# Altium schematic sheet bluetooth 3.SchDoc
size A3
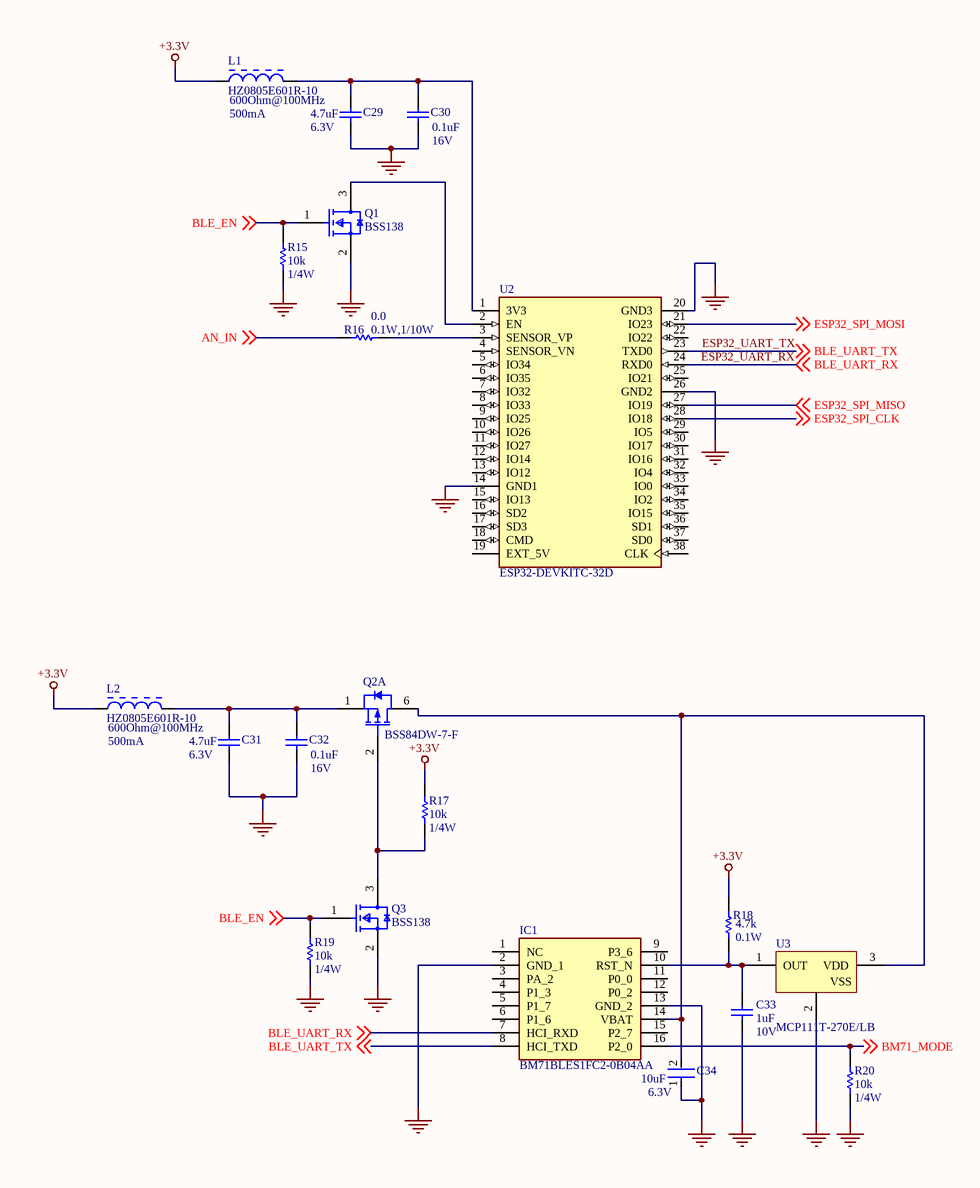
[diagram p0: bluetooth 3.SchDoc]

## Parts
C29  value 4.7uF  Voltage: 6.3V  [CAPC2013X145X50NL20T25]  (hidden comment: C0805C475K9PACTU)
C30  value 0.1uF  Voltage: 16V  [CAPC1608X87X35ML15T15]  (hidden comment: C0603C104M4RACTU)
C31  value 4.7uF  Voltage: 6.3V  [CAPC2013X145X50NL20T25]  (hidden comment: C0805C475K9PACTU)
C32  value 0.1uF  Voltage: 16V  [CAPC1608X87X35ML15T15]  (hidden comment: C0603C104M4RACTU)
C33  value 1uF  Voltage: 10V  [CAPC1608X90X35ML15T15]  (hidden comment: C0603C105K8RACTU)
C34  value 10uF  Voltage: 6.3V  [FP-CL10-IPC_C]  (hidden comment: CL10A106MQ8NNNC)
IC1  BM71BLES1FC2-0B04AA  [BM71BLES1FC2_1]
L1  HZ0805E601R-10  Impedance @ Frequency: 600Ohm@100MHz  Current Rating (Max): 500mA  [LIRD-LI0805H151R-10-2_V]
L2  HZ0805E601R-10  Impedance @ Frequency: 600Ohm@100MHz  Current Rating (Max): 500mA  [LIRD-LI0805H151R-10-2_V]
Q1  BSS138  [FP-318-08-IPC_B]
Q2  BSS84DW-7-F  [DIOD-SOT363-6_V]  (part A of 2)
Q3  BSS138  [FP-318-08-IPC_B]
R15  value 10k  Power: 1/4W  [RESC3216X70X50NL05T20]  (hidden comment: ERJ-8GEYJ103V)
R16  value 0.0  Power: 0.1W,1/10W  [RESC1608X55X35LL10T10]  (hidden comment: RC1608J000CS)
R17  value 10k  Power: 1/4W  [RESC3216X70X50NL05T20]  (hidden comment: ERJ-8GEYJ103V)
R18  value 4.7k  Power: 0.1W  [RESC1608X55X25LL10T15]  (hidden comment: RC0603FR-074K7L)
R19  value 10k  Power: 1/4W  [RESC3216X70X50NL05T20]  (hidden comment: ERJ-8GEYJ103V)
R20  value 10k  Power: 1/4W  [RESC3216X70X50NL05T20]  (hidden comment: ERJ-8GEYJ103V)
U2  ESP32-DEVKITC-32D  [MODULE_ESP32-DEVKITC-32D]
U3  MCP111T-270E/LB  [SC70-LB3_N]

## Nets
+3.3V: L1.1 L2.1 R17.1 R18.2
GND: C29.1 C30.1 C31.1 C32.1 C33.1 C34.1 IC1.2(GND_1) IC1.13(GND_2) Q1.2(S) Q3.2(S) R15.2 R19.2 R20.2 U2.14(GND1) U2.20(GND3) U2.26(GND2) U3.2(VSS)
AN_IN: R16.1 ; off-sheet AN_IN
BLE_EN: Q1.1(G) Q3.1(G) R15.1 R19.1 ; off-sheet BLE_EN
BM71_MODE: IC1.16(P2_0) R20.1 ; off-sheet BM71_MODE
ESP32_SPI_CLK: U2.28(IO18) ; off-sheet ESP32_SPI_CLK
ESP32_SPI_MISO: U2.27(IO19) ; off-sheet ESP32_SPI_MISO
ESP32_SPI_MOSI: U2.21(IO23) ; off-sheet ESP32_SPI_MOSI
ESP32_UART_RX: IC1.7(HCI_RXD) U2.24(RXD0) ; off-sheet BLE_UART_RX  [also labelled BLE_UART_RX]
ESP32_UART_TX: IC1.8(HCI_TXD) U2.23(TXD0) ; off-sheet BLE_UART_TX  [also labelled BLE_UART_TX]
NetC29_2: C29.2 C30.2 L1.2 U2.1(3V3)
NetC31_2: C31.2 C32.2 L2.2 Q2.1(S)
NetC33_2: C33.2 IC1.10(RST_N) R18.1 U3.1(OUT)
NetC34_2: C34.2 IC1.14(VBAT) Q2.6(D) U3.3(VDD)
NetQ1_3: Q1.3(D) U2.2(EN)
NetQ2_2: Q2.2(G) Q3.3(D) R17.2
NetR16_2: R16.2 U2.3(SENSOR_VP)

Not connected (* = marked no-connect by the designer): IC1 1(NC) 3(PA_2) 4(P1_3) 5(P1_7) 6(P1_6) 9(P3_6) 11(P0_0) 12(P0_2) 15(P2_7); U2 4(SENSOR_VN) 5(IO34) 6(IO35) 7(IO32) 8(IO33) 9(IO25) 10(IO26) 11(IO27) 12(IO14) 13(IO12) 15(IO13) 16(SD2) 17(SD3) 18(CMD) 19(EXT_5V) 22(IO22) 25(IO21) 29(IO5) 30(IO17) 31(IO16) 32(IO4) 33(IO0) 34(IO2) 35(IO15) 36(SD1) 37(SD0) 38(CLK)

## Notes on the sheet
- Title
- Size:
- Date:
- A3
- Number:
- Time:
- Revision:
- Sheet
- of
- File:

## Library data of the parts
C29 C31 = CMP-2007-01009-1: Manufacturer: Kemet; Alternative1: GRM219R61A475KE34D Murata; Alternative2: C0805C475K3PACTU KEMET; Alternative3: CC0805KKX5R7BB475 Yageo; Part Number: C0805C475K9PACTU; Package / Case: 0805
C30 C32 = CMP-2006-03067-1: Ceramic Capacitor 0.1uF 16V +-10% X7R0603; Manufacturer: Kemet; Alternative1: C1608X7R1E104K TDK; Alternative2: CC0603KRX7R8BB104 Yageo; Alternative3: GRM188R72A104KA35D Murata; Part Number: C0603C104M4RACTU; Package / Case: 0603
C33 = CMP-2006-02293-1: Manufacturer: Kemet; Alternative1: CL10B105KO8NNND Samsung; Alternative2: CC0603KPX7R7BB105 Yageo; Alternative3: GRM188R71C105KE15D Murata; Part Number: C0603C105K8RACTU; Package / Case: 0603
C34 = CMP-13271-001938-1: Cap Ceramic 10uF 6.3V X5R ±20% Pad SMD 0603 +85°C T/R; Manufacturer: Samsung; Alternative1: LMK107BJ106MALTD Taiyo Yuden; Alternative2: C1608X5R0J106K080AB TDK; Alternative3: 06036D106MAT2A Kyocera AVX; Height: 0.8mm; Width: 0.031inch; Min Operating Temperature: -55°C; Dielectric: X5R; Package / Case: 0603; Radiation Hardening: No; Packaging: Tape and Reel; Max Operating Temperature: 85°C; Thickness: 0.035inch; Mount: Surface Mount; Case Code (Imperial): 0603; Case Code (Metric): 1608; Depth: 0.8mm; Tolerance: 20%; Length: 1.6mm; Part Number: CL10A106MQ8NNNC
IC1 = BM71BLES1FC2-0B04AA: Integrated Circuit; Manufacturer_Name: Microchip; Datasheet Link: http://www.microchip.com/mymicrochip/filehandler.aspx?ddocname=en578477; Manufacturer_Part_Number: BM71BLES1FC2-0B04AA; Arrow Part Number: BM71BLES1FC2-0B04AA; Arrow Price/Stock: https://www.arrow.com/en/products/bm71bles1fc2-0b04aa/microchip-technology; Mouser Part Number: 579-BM71BS1FC2-BB04; Mouser Price/Stock: https://www.mouser.co.uk/ProductDetail/Microchip-Technology/BM71BLES1FC2-0B04AA?qs=w%2Fv1CP2dgqqgFQsF1zIUBg%3D%3D
L1 L2 = CMP-2000-05194-1: Chip Bead for Signal Filtering, 600 Ohm, 500 mA, -40 to 125 degC, 0805 (2012 Metric), RoHS, Tape and Reel; Manufacturer: Laird; Other Names: 240-2399-1; Kits: 240-2227-ND-KITEMIFERRITEBEADCHIPSMD; DC Resistance (DCR) (Max): 300mOhm; Filter Type: SignalLine; Operating Temperature: -40degC~125degC; Datasheet URL: https://datasheet.ciiva.com/22622/1685710-22622833.pdf; Mounting Type: SurfaceMount; Package / Case: 0805(2012Metric); Package Description: 2-Pin Surface Mount Device, Body 2 x 1.25 mm; Package Reference: LI0805H15R-10-2; Size / Dimension: 0.079"Lx0.049"W(2.00mmx1.25mm); Height (Max): 0.043"(1.10mm); Part Number: HZ0805E601R-10
Q1 Q3 = CMP-07173-000101-1: MOSFET N-CH 50V 220MA SOT-23; Turn-Off Delay Time: 20ns; Element Configuration: Single; Rds On Max: 3.5R; Gate to Source Voltage (Vgs): 20V; Threshold Voltage: 1.3V; Number of Elements: 1; Power Dissipation: 360mW; Rise Time: 9ns; Turn-On Delay Time: 2.5ns; Input Capacitance: 27pF; On-State Resistance: 6R; Alternative1: BSS138LT3G ON Semiconductor; Alternative2: BSS138W-7-F Diodes; Alternative3: 2N7002 STMicroelectronics; Lead Free: Lead Free; Length: 2.92mm; Width: 1.3mm; Drain to Source Breakdown Voltage: 50V; Min Operating Temperature: -55°C; REACH SVHC: No SVHC; Packaging: Tape and Reel; Radiation Hardening: No; Height: 0.93mm; Drain to Source Voltage (Vdss): 50V; Current Rating: 220mA; Voltage Rating (DC): 50V; Weight: 0.03g; Continuous Drain Current (ID): 220mA; Number of Pins: 3; Nominal Vgs: 1.3V; Max Power Dissipation: 360mW; Fall Time: 9ns; Drain to Source Resistance: 3.5R; Contact Plating: Tin; Case/Package: SOT-23; Package Quantity: 1; Dual Supply Voltage: 50V; Mount: Surface Mount; Termination: SMD/SMT; Max Operating Temperature: 150°C
Q2 = CMP-2000-05971-1: Dual P-Channel Enhancement Mode MOSFET, 50 VDS, -55 to 150 degC, 6-Pin SOT363, RoHS, Tape and Reel; Manufacturer: DiodesIncorporated; Vgs - Gate-Source Voltage: 20V; Typical Turn-On Delay Time: 10ns; Forward Transconductance - Min: 0.05S; Id - Continuous Drain Current: -130mA; Transistor Type: 2P-Channel; Typical Turn-Off Delay Time: 18ns; Unit Weight: 0.000212oz; Vds - Drain-Source Breakdown Voltage: -50V; Number of Channels: 2Channel; Pd - Power Dissipation: 300mW; Type: EnhancementModeFieldEffectTransistor; Rds On - Drain-Source Resistance: 6Ohms; Package Description: 6-Pin Small Outline Transistor, Body 1.25 x 2 mm, Pitch 0.65 mm; RoHS: True; Manufacturer URL: http://www.diodes.com/; Packaging: Reel; Series: BSS84; Mounting Style: SMD/SMT; Technology: Si; Height: 1mm; Configuration: Dual; Package Reference: SOT363-6; Length: 2.2mm; Mounting Technology: SurfaceMount; Factory Pack Quantity: 3000; Brand: DiodesIncorporated; Maximum Operating Temperature: +150C; Minimum Operating Temperature: -55C; Product Category: MOSFET; Datasheet URL: http://www.diodes.com/_files/datasheets/ds30204.pdf; Width: 1.35mm; Product: MOSFETSmallSignal; Channel Mode: Enhancement; Transistor Polarity: P-Channel; Datasheet Version: Rev. 18-2, 01/2014; Package / Case: SOT-363-6
R15 R17 R19 R20 = CMP-2003-00545-1: Res Thick Film 1206 10k Ohms 5% 1/4W; Manufacturer: Panasonic; Alternative1: CR1206F-10KFI TT Welwyn; Alternative2: WR12X1002FGL Walsin Technologies; Alternative3: CR1206-FX-1002ELF Bourns; Part Number: ERJ-8GEYJ103V; Package / Case: 1206
R16 = CMP-2000-06972-1: Chip Resistor, 0 Ohm, +/- 5%, 0.1 W, -55 to 155 degC, 0603 (1608 Metric), RoHS, Tape and Reel; Manufacturer: Samsung-Electro-Mechanics-America,-Inc.; Tolerance: Jumper; Alternative1: RC0603JR-130RL Yageo; Alternative2: RC0603JR-100RL Yageo; Alternative3: CRCW0603-0000Z0EA Vishay; Manufacturer URL: http://www.samsungsem.com/global/index.jsp; Features: MoistureResistant; Mounting Technology: SurfaceMount; Series: RC; Package / Case: 0603(1608Metric); Category: Resistors; Operating Temperature: -55°C~155°C; Datasheet URL: http://static6.arrow.com/aropdfconversion/3cece72dd289ffbadc164fbcd05f638dd7240f7b/rc_datasheet_150330.pdf.pdf?authToken=eyJ0eXAiOiJKV1QiLCJhbGciOiJIUzI1NiJ9.eyJTZXNzaW9uSWQiOiJtY3ZlYXdxYmptZXdpdXdyeG1ha2FxdWciLCJEb3dubG9hZFR5cGUiOiJEYXRhc2hlZXRzIiwiaXNzIjoic2VsZiIsImF1ZCI6Imh0dHA6Ly9kYXRhc2hlZXRhdXRoLmFycm93LmNvbSIsImV4cCI6MTQ3Njg1OTQ5NiwibmJmIjoxNDc2ODU5Mzc2fQ.1rZWSrRNyHkP6J5YmszFzS2kzmlbN9BKNvWJ4ACiP-Q; Datasheet Version: 09/2015; Composition: ThickFilm; Package Description: 2-Pin Chip Resistor, Body 1.6 x 0.8 mm; Height: 0.022"(0.55mm); Family: ChipResistor-SurfaceMount; Temperature Coefficient: -; Size / Dimension: 0.063"Lx0.031"W(1.60mmx0.80mm); Part Number: RC1608J000CS
R18 = CMP-2000-06942-1: Chip Resistor, 4.7 KOhm, +/- 1%, 0.1 W, -55 to 155 degC, 0603 (1608 Metric), RoHS, Tape and Reel; Manufacturer: Yageo; Temperature Coefficient: 100PPM/C; Voltage Rating: 50V; Package / Case: 0603; Series: RC; Datasheet URL: http://www.yageo.com/documents/recent/PYu-RC_Group_51_RoHS_L_7.pdf; Case Code - mm: 1608; Operating Temperature Range: -55Cto+155C; Tolerance: 1%
U2 = ESP32-DEVKITC-32D: - Transceiver; 802.11 b/g/n _Wi-Fi, WiFi, WLAN_, BluetoothÂ® Smart Ready 4.x Dual Mode For Use With ESP-WROOM-32; MF: Espressif Systems; Package: None; Price: None; Availability: Unavailable; MP: ESP32-DEVKITC-32D; SnapEDA_Link: https://www.snapeda.com/parts/ESP32-DEVKITC-32D/Espressif%20Systems/view-part/2777395/?ref=snap; Value: *
U3 = CMP-0130-00048-1: 1.75Î¼A Micropower Voltage Detector, Open-Drain Output, 2.63V, 3-Pin SC-70, Extended Temperature, Tape and Reel; PackageVersion: revBB, Aug-2009; PackageReference: SC70-LB3; DatasheetVersion: revD, Jun-2005; PackageDescription: 3-Lead Plastic Small Outline Transistor (LB) [SC70]